# Altium schematic sheet LPCB235 - ANALOG CONNECTOR.SchDoc
size A3; Address1: Factory 10; Address2: 9-13 Dingley Avenue, Dandeong, VICTORIA 3175, AUSTRALIA; DocumentNumber: 2; Revision: 1; SheetNumber: 2; SheetTotal: 37; Lockie__PCB_SUB_ASSEMBLY: Connector; Lockie__PCB_ASSEMBLY: FCU PCB; Lockie__LDL: LPCB235; Lockie__PCB_DESCRIPTION: Flight Control Unit
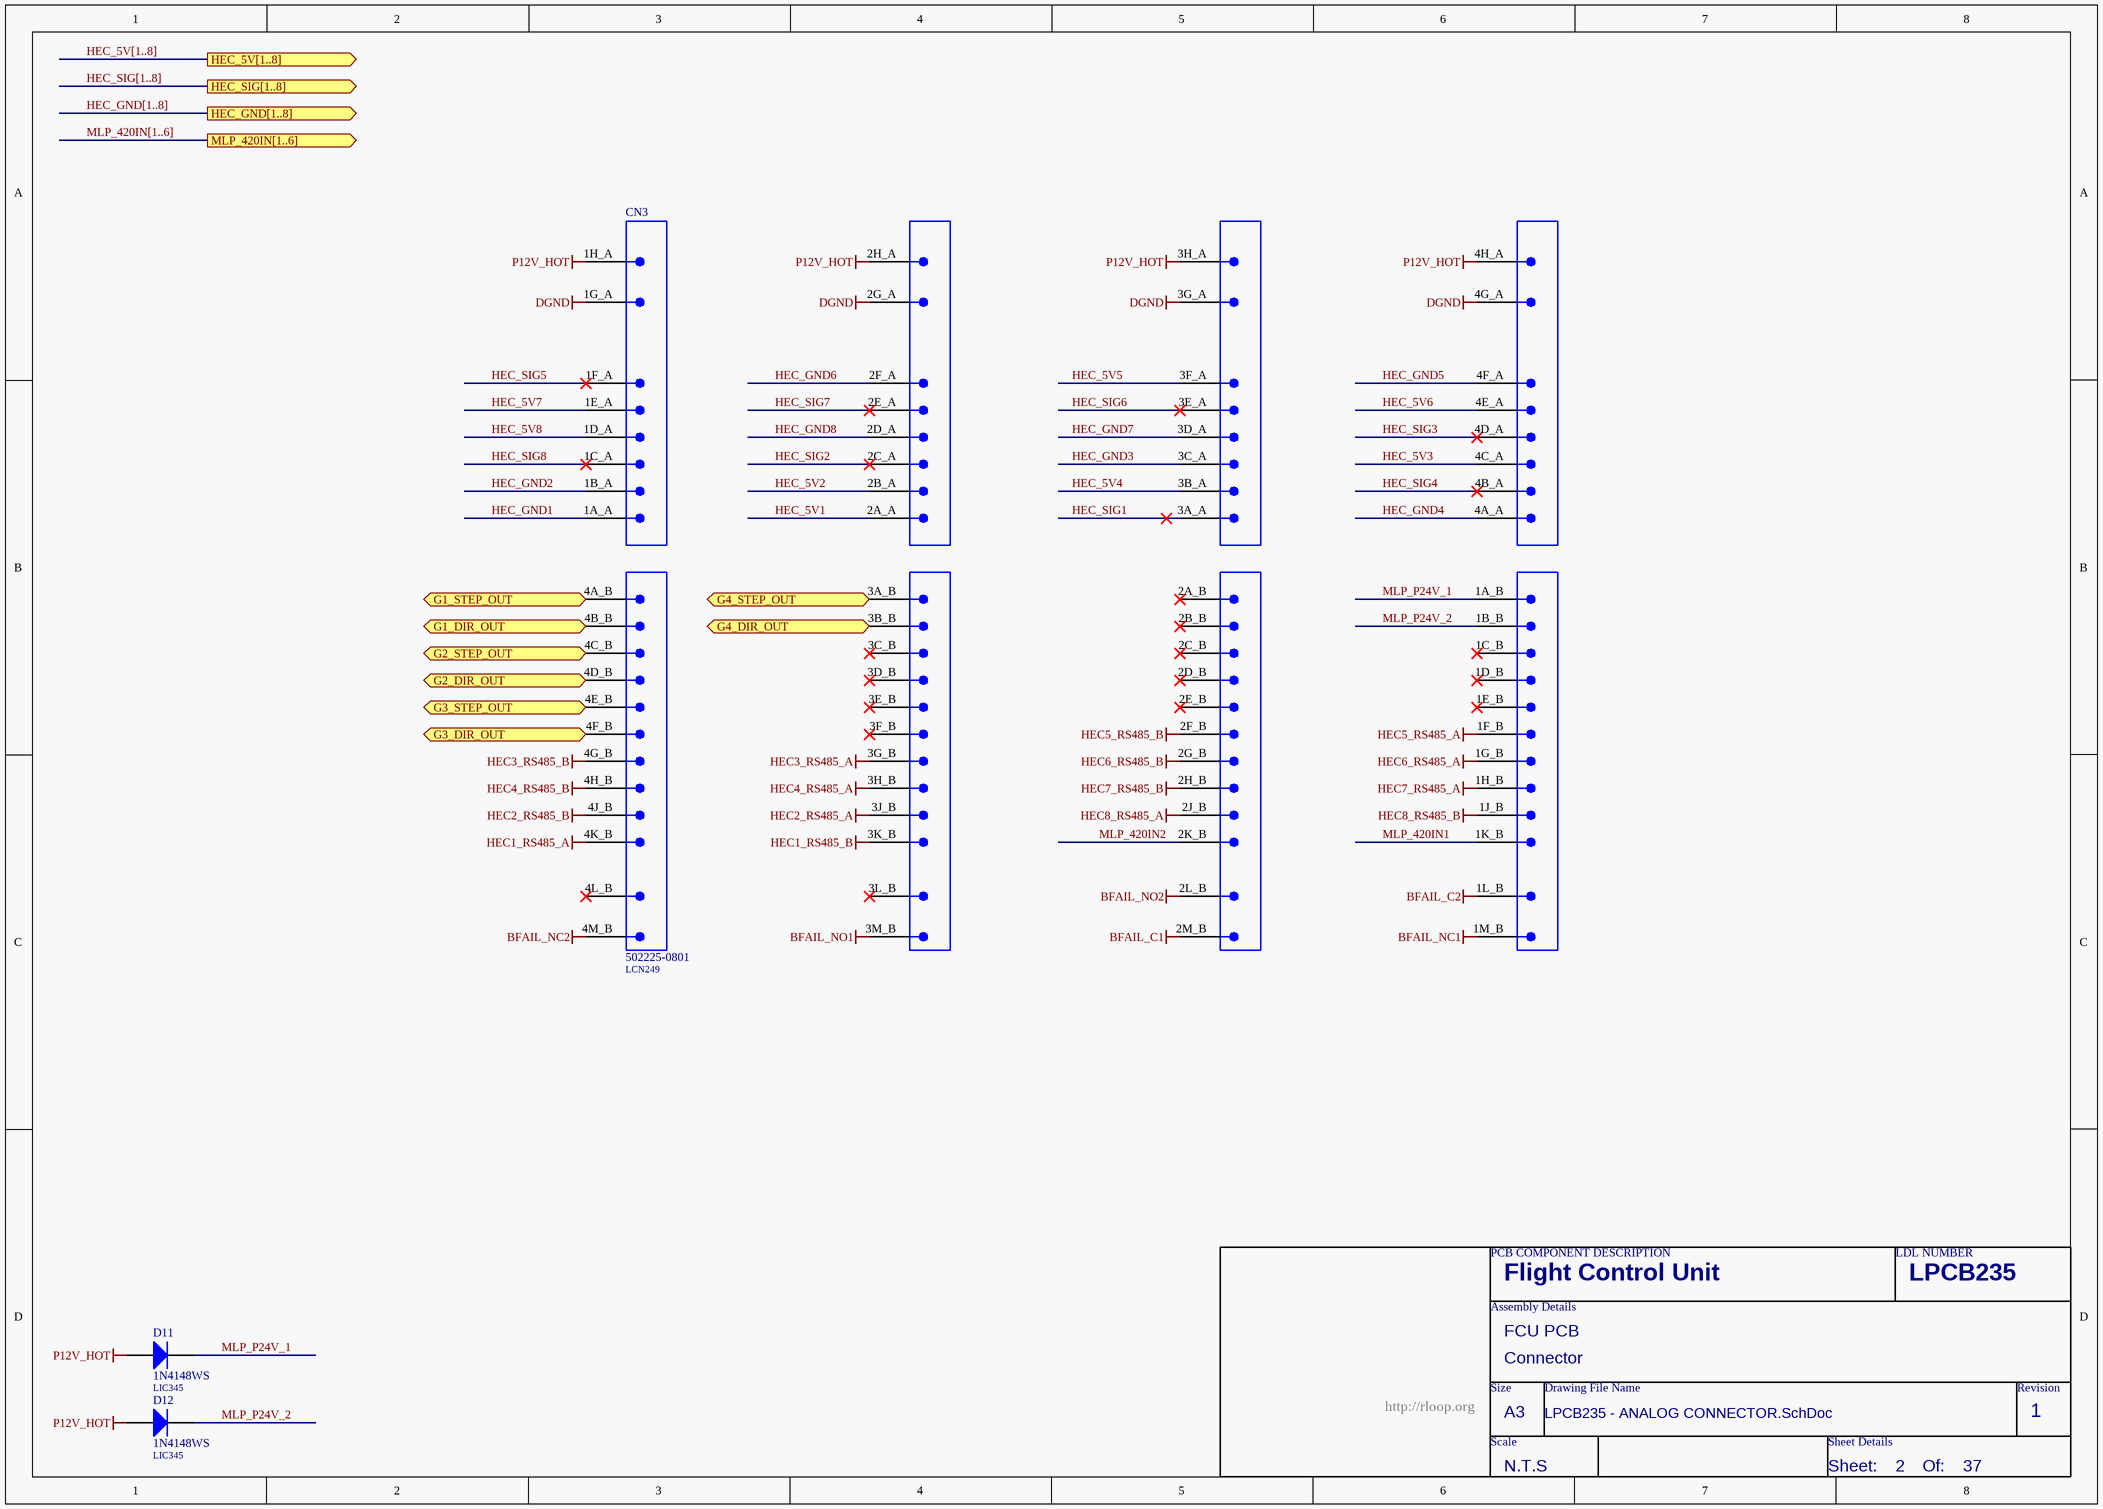
[diagram p0: LPCB235 - ANALOG CONNECTOR.SchDoc]

## Parts
CN3  502225-0801  LDL_NUMBER: LCN249  [502225-0801]
D11  1N4148WS  LDL_NUMBER: LIC345  [LFP001__SOD-323F]
D12  1N4148WS  LDL_NUMBER: LIC345  [LFP001__SOD-323F]

## Ports
G1_DIR_OUT (in), G1_STEP_OUT (in), G2_DIR_OUT (in), G2_STEP_OUT (in), G3_DIR_OUT (in), G3_STEP_OUT (in), G4_DIR_OUT (in), G4_STEP_OUT (in), HEC_5V[1..8] (out), HEC_GND[1..8] (out), HEC_SIG[1..8] (out), MLP_420IN[1..6] (out)

## Nets
BFAIL_C1: CN3.2M_B
BFAIL_C2: CN3.1L_B
BFAIL_NC1: CN3.1M_B
BFAIL_NC2: CN3.4M_B
BFAIL_NO1: CN3.3M_B
BFAIL_NO2: CN3.2L_B
DGND: CN3.1G_A(1G) CN3.2G_A(2G) CN3.3G_A(3G) CN3.4G_A(4G)
HEC1_RS485_A: CN3.4K_B
HEC1_RS485_B: CN3.3K_B
HEC2_RS485_A: CN3.3J_B
HEC2_RS485_B: CN3.4J_B
HEC3_RS485_A: CN3.3G_B
HEC3_RS485_B: CN3.4G_B
HEC4_RS485_A: CN3.3H_B
HEC4_RS485_B: CN3.4H_B
HEC5_RS485_A: CN3.1F_B
HEC5_RS485_B: CN3.2F_B
HEC6_RS485_A: CN3.1G_B
HEC6_RS485_B: CN3.2G_B
HEC7_RS485_A: CN3.1H_B
HEC7_RS485_B: CN3.2H_B
HEC8_RS485_A: CN3.2J_B
HEC8_RS485_B: CN3.1J_B
P12V_HOT: CN3.1H_A(1H) CN3.2H_A(2H) CN3.3H_A(3H) CN3.4H_A(4H) D11.2(A) D12.2(A)
G1_DIR_OUT: CN3.4B_B ; port G1_DIR_OUT
G1_STEP_OUT: CN3.4A_B ; port G1_STEP_OUT
G2_DIR_OUT: CN3.4D_B ; port G2_DIR_OUT
G2_STEP_OUT: CN3.4C_B ; port G2_STEP_OUT
G3_DIR_OUT: CN3.4F_B ; port G3_DIR_OUT
G3_STEP_OUT: CN3.4E_B ; port G3_STEP_OUT
G4_DIR_OUT: CN3.3B_B ; port G4_DIR_OUT
G4_STEP_OUT: CN3.3A_B ; port G4_STEP_OUT
HEC_5V1: CN3.2A_A(2A)
HEC_5V2: CN3.2B_A(2B)
HEC_5V3: CN3.4C_A(4C)
HEC_5V4: CN3.3B_A(3B)
HEC_5V5: CN3.3F_A(3F)
HEC_5V6: CN3.4E_A(4E)
HEC_5V7: CN3.1E_A(1E)
HEC_5V8: CN3.1D_A(1D)
HEC_GND1: CN3.1A_A(1A)
HEC_GND2: CN3.1B_A(1B)
HEC_GND3: CN3.3C_A(3C)
HEC_GND4: CN3.4A_A(4A)
HEC_GND5: CN3.4F_A(4F)
HEC_GND6: CN3.2F_A(2F)
HEC_GND7: CN3.3D_A(3D)
HEC_GND8: CN3.2D_A(2D)
HEC_SIG1: CN3.3A_A(3A)
HEC_SIG2: CN3.2C_A(2C)
HEC_SIG3: CN3.4D_A(4D)
HEC_SIG4: CN3.4B_A(4B)
HEC_SIG5: CN3.1F_A(1F)
HEC_SIG6: CN3.3E_A(3E)
HEC_SIG7: CN3.2E_A(2E)
HEC_SIG8: CN3.1C_A(1C)
MLP_420IN1: CN3.1K_B
MLP_420IN2: CN3.2K_B
MLP_P24V_1: CN3.1A_B D11.1(K)
MLP_P24V_2: CN3.1B_B D12.1(K)

Not connected (* = marked no-connect by the designer): CN3 1C_B* 1D_B* 1E_B* 2A_B* 2B_B* 2C_B* 2D_B* 2E_B* 3C_B* 3D_B* 3E_B* 3F_B* 3L_B* 4L_B*

## Buses and harness runs
bus HEC_5V[1..8] = port HEC_5V[1..8]
bus HEC_GND[1..8] = port HEC_GND[1..8]
bus HEC_SIG[1..8] = port HEC_SIG[1..8]
bus MLP_420IN[1..6] = port MLP_420IN[1..6]

## Notes on the sheet
- PCB COMPONENT DESCRIPTION
- LDL NUMBER
- Assembly Details
- Size
- Drawing File Name
- Revision
- http://rloop.org
- Scale
- A3
- Sheet Details
- N.T.S
- Sheet:
- Of:

## Library data of the parts
CN3 = 502225-0801: Connector, Molex CMC, Automotive Socket, 80 Circuits, 2 Pockets; FMEDA__CHANNEL: COM; FMEDA__OPERATING__CURRENT_MAX: 0; FMEDA__OPERATING__TEMP_MAX: 50; FMEDA__OPERATING__TEMP_MIN: -20; FMEDA__OPERATING__TEMP_TYP: 27; FMEDA__OPERATING__VOLTAGE_MAX: 16; FMEDA__OPERATING__VOLTAGE_TYP: 12; FMEDA__FUNCTION_IN_SYSTEM: *; FMEDA__OPERATING__CURRENT_MIN: 0; FMEDA__OPERATING__CURRENT_TYP: 0; FMEDA__OPERATING__VOLTAGE_MIN: 0
D11 D12 = 1N4148WS: Diode, Small Signal, SMD SOD-323F [LIC345]; FMEDA__FUNCTION_IN_SYSTEM: ACCEL PSU INPUT DIODE; FMEDA__OPERATING__TEMP_MAX: 50; FMEDA__OPERATING__TEMP_MIN: -20; FMEDA__OPERATING__TEMP_TYP: 27; FMEDA__OPERATING__VOLTAGE_MAX: 0; FMEDA__CHANNEL: COM; FMEDA__OPERATING__VOLTAGE_MIN: 0; FMEDA__OPERATING__VOLTAGE_TYP: 0; FMEDA__OPERATING__CURRENT_MAX: 0; FMEDA__OPERATING__CURRENT_MIN: 0; FMEDA__OPERATING__CURRENT_TYP: 0